# Altium schematic sheet miniESP.SchDoc
size A
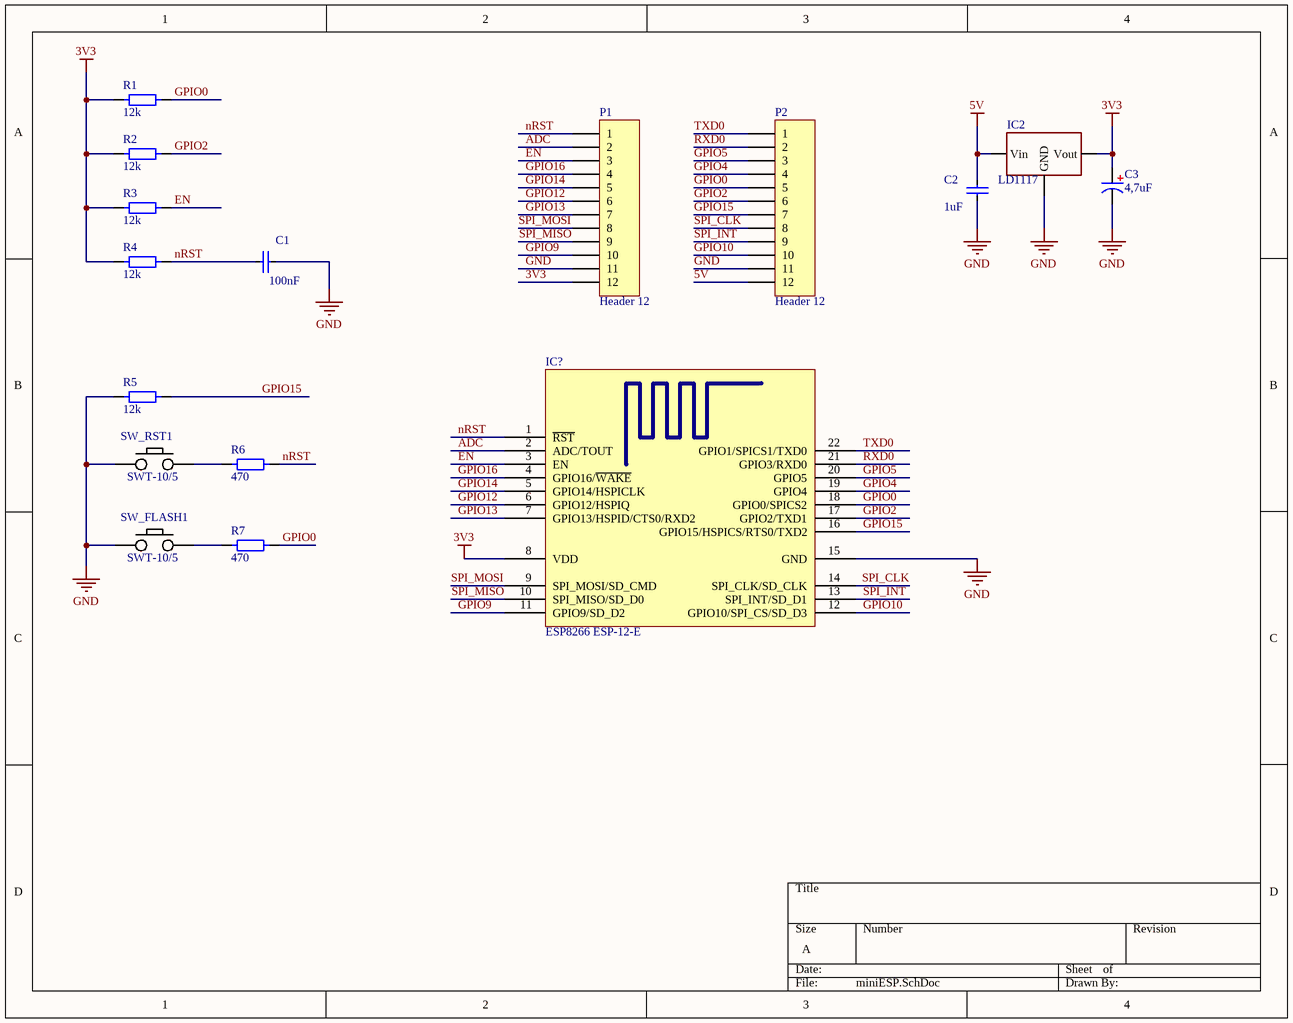
[diagram p0: miniESP.SchDoc]

## Parts
C1  value 100nF  [C0603]  (hidden comment: Cap)
C2  value 1uF  [C1210]  (hidden comment: Cap)
C3  value 4,7uF  [C_POLAR A]  (hidden comment: Cap Polar)
IC2  LD1117  [LD1117]
IC?  ESP8266 ESP-12-E  [ESP8266 ESP-12-E TOP]
P1  Header 12  [HDR1X12]
P2  Header 12  [HDR1X12]
R1  value 12k  [R0603]  (hidden comment: Res)
R2  value 12k  [R0603]  (hidden comment: Res)
R3  value 12k  [R0603]  (hidden comment: Res)
R4  value 12k  [R0603]  (hidden comment: Res)
R5  value 12k  [R0603]  (hidden comment: Res)
R6  value 470  [R0603]  (hidden comment: Res)
R7  value 470  [R0603]  (hidden comment: Res)
SW_FLASH1  SWT-10/5  [SWT-10/5]
SW_RST1  SWT-10/5  [SWT-10/5]

## Nets
3V3: C3.cap_polar_1 IC2.ld1117_vout(Vout) IC?.8(VDD) P1.12 R1.res_1 R2.res_1 R3.res_1 R4.res_1
5V: C2.cap_1 IC2.ld1117_vin(Vin) P2.12
GND: C1.cap_2 C2.cap_2 C3.cap_polar_2 IC2.ld1117_gnd(GND) IC?.15(GND) P1.11 P2.11 R5.res_1 SW_FLASH1.3 SW_RST1.3
ADC: IC?.2(ADC/TOUT) P1.2
EN: IC?.3(EN) P1.3 R3.res_2
GPIO0: IC?.18(GPIO0/SPICS2) P2.5 R1.res_2 R7.res_2
GPIO2: IC?.17(GPIO2/TXD1) P2.6 R2.res_2
GPIO4: IC?.19(GPIO4) P2.4
GPIO5: IC?.20(GPIO5) P2.3
GPIO9: IC?.11(GPIO9/SD_D2) P1.10
GPIO10: IC?.12(GPIO10/SPI_CS/SD_D3) P2.10
GPIO12: IC?.6(GPIO12/HSPIQ) P1.6
GPIO13: IC?.7(GPIO13/HSPID/CTS0/RXD2) P1.7
GPIO14: IC?.5(GPIO14/HSPICLK) P1.5
GPIO15: IC?.16(GPIO15/HSPICS/RTS0/TXD2) P2.7 R5.res_2
GPIO16: IC?.4(GPIO16/~{WAKE}) P1.4
nRST: C1.cap_1 IC?.1(~{RST}) P1.1 R4.res_2 R6.res_2
RXD0: IC?.21(GPIO3/RXD0) P2.2
SPI_CLK: IC?.14(SPI_CLK/SD_CLK) P2.8
SPI_INT: IC?.13(SPI_INT/SD_D1) P2.9
SPI_MISO: IC?.10(SPI_MISO/SD_D0) P1.9
SPI_MOSI: IC?.9(SPI_MOSI/SD_CMD) P1.8
TXD0: IC?.22(GPIO1/SPICS1/TXD0) P2.1
NetR6_res_1: R6.res_1 SW_RST1.4
NetR7_res_1: R7.res_1 SW_FLASH1.4

## Library data of the parts
P1 P2 = Header 12: Header, 12-Pin; LatestRevisionDate: 17-Jul-2002; LatestRevisionNote: Re-released for DXP Platform.; Publisher: Altium Limited